# EAGLE board poseidon (EAGLE 9.2.2)
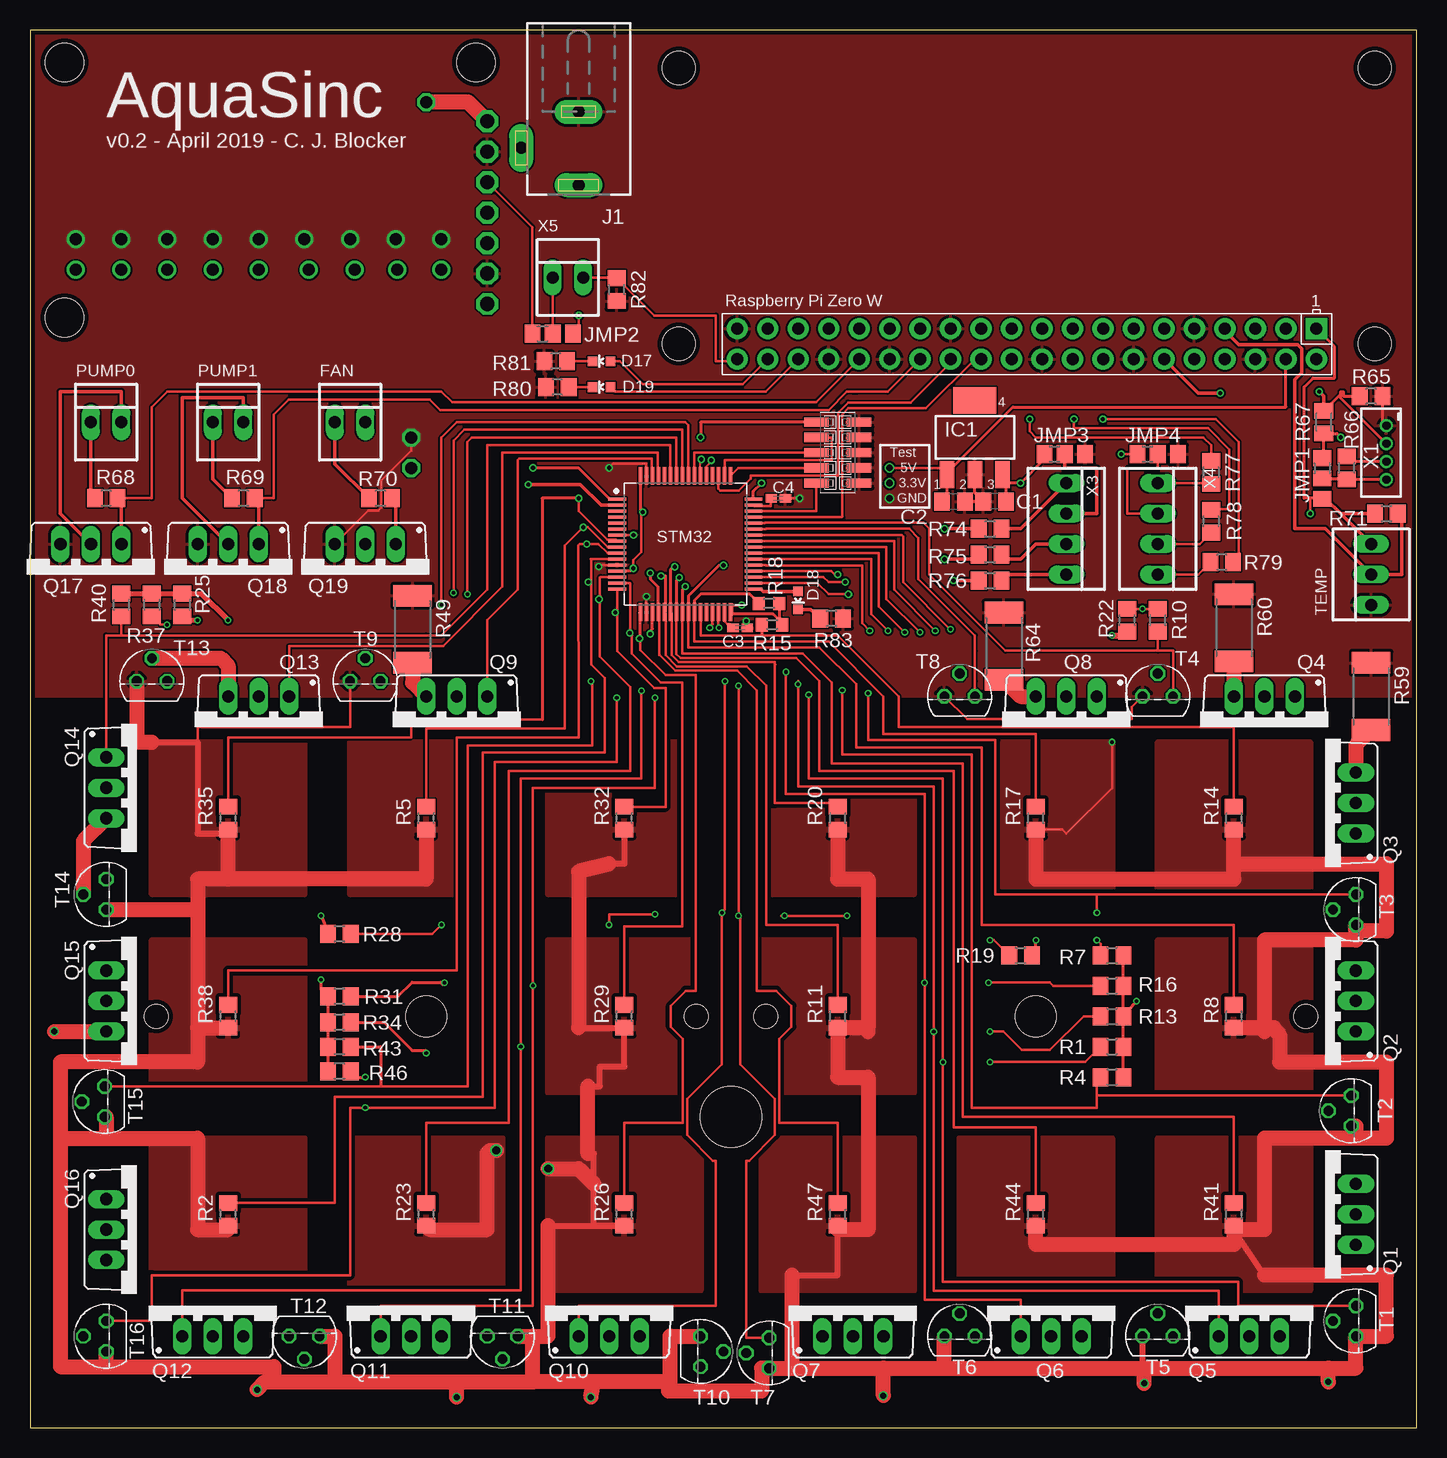
[diagram p3: board, top side]
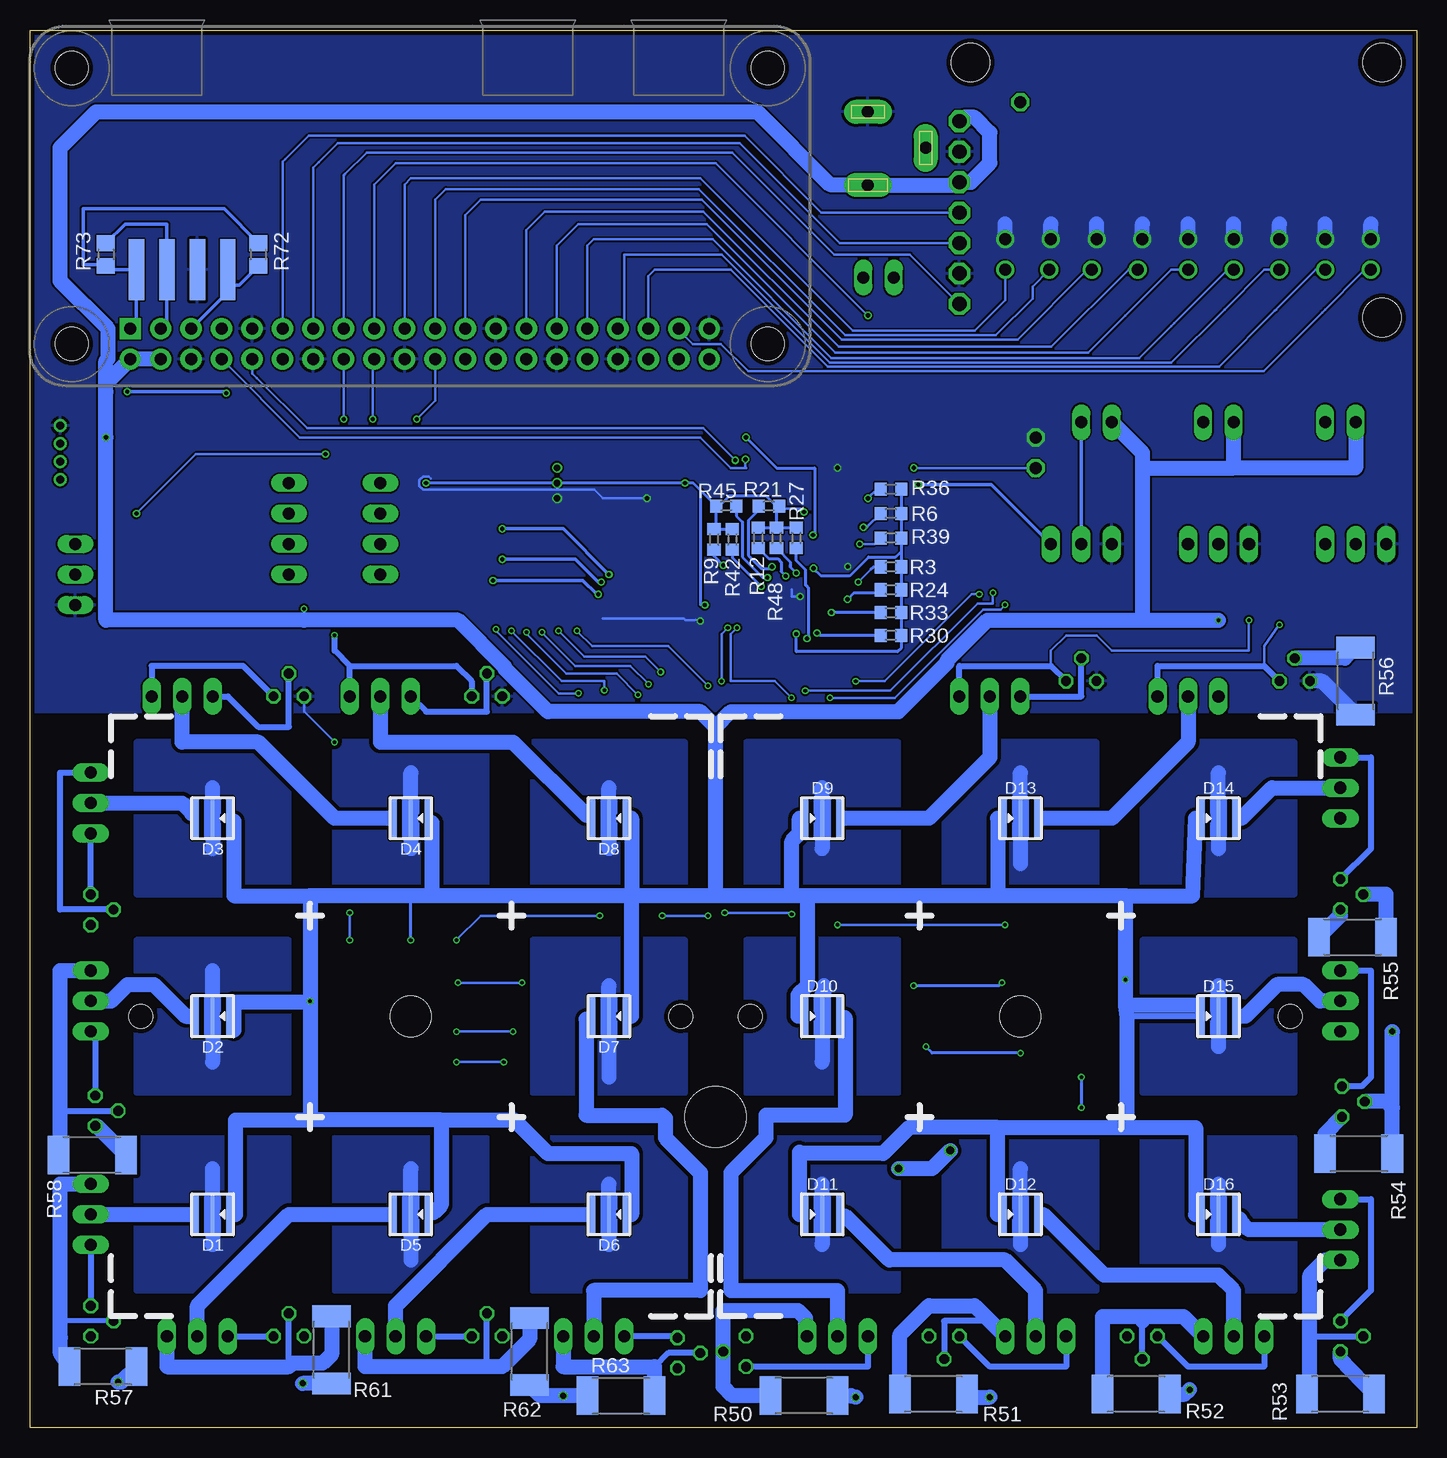
[diagram p4: board, bottom side, seen from below]

Size 115.55 x 116.51 mm. Coordinates in mm from the lower left corner, seen from the top.
Outline: 0,0 115.55,0 115.55,116.51 0,116.51 0,0
Copper layers (1*16): Top 0.035559375mm / dielectric 1.6mm / Bottom 0.035559375mm
Design rules "oshpark-2layer": minimum track width 6mil, minimum drill 10mil, track to track 6mil, track to pad 6mil, pad to pad 6mil, via to via 6mil, smd to smd 6mil, copper to edge 15mil, drill to drill 6mil, minimum pad ring 5mil, minimum via ring 5mil, stop-mask expansion 2.5mil, vias tented up to drill 0mil, thermal gap 10mil
Holes 5.08 mm at 58.42,25.91

## Footprints (pad centres in the part's own frame; a part is rotated, then mirrored left to right if it is on the bottom)
C0805 = smd 1.3 x 1.5: 1 -0.95,0; 2 0.95,0
C0402K = smd 0.925 x 0.74: 1 -0.6,0; 2 0.6,0
CREE-XT-E = smd 0.5 x 3.3: A -1.4,0; K 1.4,0 | smd 0.3 x 3.3: THERMAL 0,0
LED-0603 = smd 0.8 x 0.8: A 0,-0.75; C 0,0.75
22-23-2021 = drill 1 long: 1 -1.27,0; 2 1.27,0
SOT223 = smd 1.219 x 2.235: 1 -2.311,-3.099; 2 0,-3.099; 3 2.311,-3.099 | smd 3.6 x 2.2: 4 0,3.099
DCJ0202 = drill 1 pad 2 long: 1 0,3.1; 2 4.8,0; 3 0,-3
A0R-JMP = smd 1.5 x 1.3: 1 0,1.7; 2 0,0; 3 0,-1.7
TO220BV = drill 1.016 long: D 0,-2.54; G -2.54,-2.54; S 2.54,-2.54
R0805 = smd 1.3 x 1.5: 1 -0.95,0; 2 0.95,0
R0603 = smd 1 x 1.1: 1 -0.85,0; 2 0.85,0
R2512 = smd 1.8 x 3.2: 1 -2.8,0; 2 2.8,0
M0805 = smd 1.3 x 1.6: 1 -0.95,0; 2 0.95,0
TO92 = drill 0.813 octagon: 1 1.27,0; 2 0,1.905; 3 -1.27,0
22-23-2031 = drill 1 long: 1 -2.54,0; 2 0,0; 3 2.54,0
RASPBERRYPI_BASTELSTUBE_V13_RASPI_BOARD_B+_FULL = drill 1 pad 1.778 square: 1 8.37,25.23 | drill 1 pad 1.778: 2 8.37,27.77; 3 10.91,25.23; 4 10.91,27.77; 5 13.45,25.23; 6 13.45,27.77; 7 15.99,25.23; 8 15.99,27.77; 9 18.53,25.23; 10 18.53,27.77; 11 21.07,25.23; 12 21.07,27.77; 13 23.61,25.23; 14 23.61,27.77; 15 26.15,25.23; 16 26.15,27.77; 17 28.69,25.23; 18 28.69,27.77; 19 31.23,25.23; 20 31.23,27.77; 21 33.77,25.23; 22 33.77,27.77; 23 36.31,25.23; 24 36.31,27.77; 25 38.85,25.23; 26 38.85,27.77; 27 41.39,25.23; 28 41.39,27.77; 29 43.93,25.23; 30 43.93,27.77; 31 46.47,25.23; 32 46.47,27.77; 33 49.01,25.23; 34 49.01,27.77; 35 51.55,25.23; 36 51.55,27.77; 37 54.09,25.23; 38 54.09,27.77; 39 56.63,25.23; 40 56.63,27.77 | hole 2.75: 3.5,3.5; 3.5,26.5; 61.5,3.5; 61.5,26.5
QFP50P1200X1200X160-64 = smd 1.469 x 0.28: 1 -5.671,3.75; 2 -5.671,3.25; 3 -5.671,2.75; 4 -5.671,2.25; 5 -5.671,1.75; 6 -5.671,1.25; 7 -5.671,0.75; 8 -5.671,0.25; 9 -5.671,-0.25; 10 -5.671,-0.75; 11 -5.671,-1.25; 12 -5.671,-1.75; 13 -5.671,-2.25; 14 -5.671,-2.75; 15 -5.671,-3.25; 16 -5.671,-3.75; 33 5.671,-3.75; 34 5.671,-3.25; 35 5.671,-2.75; 36 5.671,-2.25; 37 5.671,-1.75; 38 5.671,-1.25; 39 5.671,-0.75; 40 5.671,-0.25; 41 5.671,0.25; 42 5.671,0.75; 43 5.671,1.25; 44 5.671,1.75; 45 5.671,2.25; 46 5.671,2.75; 47 5.671,3.25; 48 5.671,3.75 | smd 0.28 x 1.469: 17 -3.75,-5.671; 18 -3.25,-5.671; 19 -2.75,-5.671; 20 -2.25,-5.671; 21 -1.75,-5.671; 22 -1.25,-5.671; 23 -0.75,-5.671; 24 -0.25,-5.671; 25 0.25,-5.671; 26 0.75,-5.671; 27 1.25,-5.671; 28 1.75,-5.671; 29 2.25,-5.671; 30 2.75,-5.671; 31 3.25,-5.671; 32 3.75,-5.671; 49 3.75,5.671; 50 3.25,5.671; 51 2.75,5.671; 52 2.25,5.671; 53 1.75,5.671; 54 1.25,5.671; 55 0.75,5.671; 56 0.25,5.671; 57 -0.25,5.671; 58 -0.75,5.671; 59 -1.25,5.671; 60 -1.75,5.671; 61 -2.25,5.671; 62 -2.75,5.671; 63 -3.25,5.671; 64 -3.75,5.671
4PIN_SMD = smd 1.27 x 5.08: 1 -3.81,0; 2 -1.27,0; 3 1.27,0; 4 3.81,0
FOCUS_GRID = hole 3.4: 0,0 | hole 2: 22.5,0; -22.5,0
SIP = drill 1.2 octagon: 1 38.1,19.24; 2 38.1,16.7; 3 38.1,14.16; 4 38.1,11.62; 5 38.1,9.08; 6 38.1,6.54; 7 38.1,4 | hole 3.2: 2.87,24.13; 2.87,2.87; 37.16,24.13
B4B-ZR = drill 0.7 pad 1.1: 1 -2.25,0; 2 -0.75,0; 3 0.75,0; 4 2.25,0
1296-10 = smd 0.76 x 2.05: 1 -2.54,-1.78; 2 -2.54,1.78; 3 -1.27,-1.78; 4 -1.27,1.78; 5 0,-1.78; 6 0,1.78; 7 1.27,-1.78; 8 1.27,1.78; 9 2.54,-1.78; 10 2.54,1.78
22-23-2041 = drill 1 long: 1 -3.81,0; 2 -1.27,0; 3 1.27,0; 4 3.81,0

## Placement (x,y rotation side)
C1  [C0805]  80.39,77.22 180 top
C2  [C0805]  76.96,77.22 0 top
C3  2.2uF  [C0402K]  59.18,66.67 0 top
C4  [C0402K]  62.36,77.47 0 top
D1  CREE-XT-E-WHITE  [CREE-XT-E]  100.33,17.78 180 bottom
D2  CREE-XT-E-WHITE  [CREE-XT-E]  100.33,34.29 180 bottom
D3  CREE-XT-E-WHITE  [CREE-XT-E]  100.33,50.8 180 bottom
D4  CREE-XT-E-WHITE  [CREE-XT-E]  83.82,50.8 180 bottom
D5  CREE-XT-E-WHITE  [CREE-XT-E]  83.82,17.78 180 bottom
D6  CREE-XT-E-WHITE  [CREE-XT-E]  67.31,17.78 180 bottom
D7  CREE-XT-E-WHITE  [CREE-XT-E]  67.31,34.29 180 bottom
D8  CREE-XT-E-WHITE  [CREE-XT-E]  67.31,50.8 180 bottom
D9  CREE-XT-E-WHITE  [CREE-XT-E]  49.53,50.8 0 bottom
D10  CREE-XT-E-WHITE  [CREE-XT-E]  49.53,34.29 0 bottom
D11  CREE-XT-E-WHITE  [CREE-XT-E]  49.53,17.78 0 bottom
D12  CREE-XT-E-WHITE  [CREE-XT-E]  33.02,17.78 0 bottom
D13  CREE-XT-E-WHITE  [CREE-XT-E]  33.02,50.8 0 bottom
D14  CREE-XT-E-WHITE  [CREE-XT-E]  16.51,50.8 0 bottom
D15  CREE-XT-E-WHITE  [CREE-XT-E]  16.51,34.29 0 bottom
D16  CREE-XT-E-WHITE  [CREE-XT-E]  16.51,17.78 0 bottom
D17  LED0603  [LED-0603]  47.62,88.9 90 top
D18  LED0603  [LED-0603]  64.01,68.96 180 top
D19  LED0603  [LED-0603]  47.62,86.74 90 top
FAN  22-23-2021  [22-23-2021]  26.67,83.82 0 top
IC1  MCP1703DB  [SOT223]  78.74,82.55 0 top
J1  DCJ0202  [DCJ0202]  45.72,106.68 180 top
JMP1  0R-JUMPA  [A0R-JMP]  107.7,79.12 0 top
JMP2  0R-JUMPA  [A0R-JMP]  43.56,91.19 90 top
JMP3  0R-JUMPA  [A0R-JMP]  86.23,81.15 90 top
JMP4  0R-JUMPA  [A0R-JMP]  93.98,81.15 90 top
PUMP0  22-23-2021  [22-23-2021]  6.35,83.82 0 top
PUMP1  22-23-2021  [22-23-2021]  16.51,83.82 0 top
Q1  IRF512  [TO220BV]  107.95,17.78 90 top
Q2  IRF512  [TO220BV]  107.95,35.56 90 top
Q3  IRF512  [TO220BV]  107.95,52.07 90 top
Q4  IRF512  [TO220BV]  102.87,58.42 180 top
Q5  IRF512  [TO220BV]  101.6,10.16 0 top
Q6  IRF512  [TO220BV]  85.09,10.16 0 top
Q7  IRF512  [TO220BV]  68.58,10.16 0 top
Q8  IRF512  [TO220BV]  86.36,58.42 180 top
Q9  IRF512  [TO220BV]  35.56,58.42 180 top
Q10  IRF512  [TO220BV]  48.26,10.16 0 top
Q11  IRF512  [TO220BV]  31.75,10.16 0 top
Q12  IRF512  [TO220BV]  15.24,10.16 0 top
Q13  IRF512  [TO220BV]  19.05,58.42 180 top
Q14  IRF512  [TO220BV]  8.89,53.34 270 top
Q15  IRF512  [TO220BV]  8.89,35.56 270 top
Q16  IRF512  [TO220BV]  8.89,16.51 270 top
Q17  IRF512  [TO220BV]  5.08,71.12 180 top
Q18  IRF512  [TO220BV]  16.51,71.12 180 top
Q19  IRF512  [TO220BV]  27.94,71.12 180 top
R1  10k  [R0805]  90.17,31.75 0 top
R2  10k NTC  [R0805]  16.51,17.78 90 top
R3  10K  [R0603]  43.81,71.75 0 bottom
R4  10k  [R0805]  90.17,29.21 0 top
R5  10k NTC  [R0805]  33.02,50.8 90 top
R6  10K  [R0603]  43.81,76.2 0 bottom
R7  10k  [R0805]  90.17,39.37 0 top
R8  10k NTC  [R0805]  100.33,34.29 90 top
R9  10K  [R0603]  58.55,74.04 90 bottom
R10  10k  [R0805]  93.98,67.31 90 top
R11  10k NTC  [R0805]  67.31,34.29 90 top
R12  10K  [R0603]  54.86,74.17 90 bottom
R13  10k  [R0805]  90.17,34.29 0 top
R14  10k NTC  [R0805]  100.33,50.8 90 top
R15  10K  [R0603]  61.85,66.93 0 top
R16  10k  [R0805]  90.17,36.83 0 top
R17  10k NTC  [R0805]  83.82,50.8 90 top
R18  10K  [R0603]  61.59,68.71 0 top
R19  10k  [R0805]  82.55,39.37 0 top
R20  10k NTC  [R0805]  67.31,50.8 90 top
R21  10K  [R0603]  53.98,76.83 0 bottom
R22  10k  [R0805]  91.44,67.31 90 top
R23  10k NTC  [R0805]  33.02,17.78 90 top
R24  10K  [R0603]  43.81,69.85 0 bottom
R25  10k  [R0805]  12.7,68.58 90 top
R26  10k NTC  [R0805]  49.53,17.78 90 top
R27  10K  [R0603]  51.69,74.17 90 bottom
R28  10k  [R0805]  25.78,41.15 180 top
R29  10k NTC  [R0805]  49.53,34.29 90 top
R30  10K  [R0603]  43.81,66.04 0 bottom
R31  10k  [R0805]  25.78,35.94 180 top
R32  10k NTC  [R0805]  49.53,50.8 90 top
R33  10K  [R0603]  43.81,67.94 0 bottom
R34  10k  [R0805]  25.78,33.78 180 top
R35  10k NTC  [R0805]  16.51,50.8 90 top
R36  10K  [R0603]  43.81,78.23 0 bottom
R37  10k  [R0805]  10.16,68.58 90 top
R38  10k NTC  [R0805]  16.51,34.29 90 top
R39  10K  [R0603]  43.81,74.17 0 bottom
R40  10k  [R0805]  7.62,68.58 90 top
R41  10k NTC  [R0805]  100.33,17.78 90 top
R42  10K  [R0603]  57.02,74.04 90 bottom
R43  10k  [R0805]  25.78,31.75 180 top
R44  10k NTC  [R0805]  83.82,17.78 90 top
R45  10K  [R0603]  57.53,76.83 180 bottom
R46  10k  [R0805]  25.78,29.72 180 top
R47  10k NTC  [R0805]  67.31,17.78 90 top
R48  10K  [R0603]  53.34,74.17 90 bottom
R49  [R2512]  31.88,66.55 270 top
R50  [R2512]  51.05,2.67 180 bottom
R51  [R2512]  40.26,2.79 180 bottom
R52  [R2512]  23.37,2.79 180 bottom
R53  [R2512]  6.35,2.79 180 bottom
R54  [R2512]  4.83,22.86 0 bottom
R55  [R2512]  5.33,40.89 0 bottom
R56  [R2512]  5.08,62.23 90 bottom
R57  [R2512]  109.47,5.08 180 bottom
R58  [R2512]  110.36,22.73 180 bottom
R59  [R2512]  111.76,60.96 270 top
R60  [R2512]  100.33,66.67 270 top
R61  [R2512]  90.42,6.48 90 bottom
R62  [R2512]  73.91,6.35 90 bottom
R63  [R2512]  66.29,2.67 0 bottom
R64  [R2512]  81.15,65.15 270 top
R65  [R0805]  111.76,85.98 180 top
R66  [R0805]  109.73,80.01 90 top
R67  [M0805]  107.82,83.82 270 top
R68  [R0805]  6.35,77.47 180 top
R69  [R0805]  17.78,77.47 180 top
R70  [R0805]  29.21,77.47 180 top
R71  [R0805]  113.03,76.2 0 top
R72  [R0805]  96.52,97.79 270 bottom
R73  [R0805]  109.22,97.79 270 bottom
R74  [R0805]  80.01,74.93 0 top
R75  [R0805]  80.01,72.77 0 top
R76  [R0805]  80.01,70.61 0 top
R77  [R0805]  98.42,79.63 270 top
R78  [R0805]  98.42,75.56 270 top
R79  [R0805]  99.31,72.14 180 top
R80  [R0805]  43.94,86.74 180 top
R81  [R0805]  43.81,88.9 180 top
R82  [R0805]  48.9,94.87 90 top
R83  [R0805]  66.8,67.44 180 top
T1  2N5088  [TO92]  110.49,8.89 90 top
T2  2N5088  [TO92]  110.11,26.42 90 top
T3  2N5088  [TO92]  110.49,43.18 90 top
T4  2N5088  [TO92]  93.98,60.96 0 top
T5  2N5088  [TO92]  93.98,7.62 0 top
T6  2N5088  [TO92]  77.47,7.62 0 top
T7  2N5088  [TO92]  61.59,6.22 90 top
T8  2N5088  [TO92]  77.47,60.96 0 top
T9  2N5088  [TO92]  27.94,62.23 0 top
T10  2N5088  [TO92]  55.88,6.35 270 top
T11  2N5088  [TO92]  39.37,7.62 180 top
T12  2N5088  [TO92]  22.86,7.62 180 top
T13  2N5088  [TO92]  10.16,62.23 0 top
T14  2N5088  [TO92]  6.35,44.45 90 top
T15  2N5088  [TO92]  6.22,27.18 90 top
T16  2N5088  [TO92]  6.35,7.62 90 top
TEMP  22-23-2031  [22-23-2031]  111.76,71.12 90 top
U$1  RPI-ZERO  [RASPBERRYPI_BASTELSTUBE_V13_RASPI_BOARD_B+_FULL]  115.57,116.84 180 top
U$2  STM32F41  [QFP50P1200X1200X160-64]  54.61,73.66 0 top
U$3  AM2320  [4PIN_SMD]  102.87,96.52 0 bottom
U$19  8X_LED_OPTIC  [FOCUS_GRID]  33.02,34.29 0 bottom
U$20  8X_LED_OPTIC  [FOCUS_GRID]  83.82,34.29 0 bottom
U$21  SIM800L  [SIP]  0,89.66 0 top
X1  B4B-ZR  [B4B-ZR]  113.03,81.28 270 top
X2  1296-T10  [1296-10]  67.31,81.28 90 top
X3  22-23-2041  [22-23-2041]  86.36,74.93 270 top
X4  22-23-2041  [22-23-2041]  93.98,74.93 270 top
X5  22-23-2021  [22-23-2021]  44.83,95.88 0 top

## Tracks (layer width: path | path; a pad name or v marks a point on that pad's centre or on a via)
+3V3  (via drill 0.35, 0.55)
  Top 0.203: v50.27,71.63 50.27,72.33 50.92,72.99 50.92,76.33 v51.05,76.33 | U$2.64 50.86,78.7
  Top 0.254: C1.1 81.34,78.74 | 81.34,78.74 81.34,79.16 IC1.3 | v51.69,66.17 51.69,66.42 51.86,66.59 U$2.19 | R15.2 62.7,67.06 62.45,67.31 | 58.53,67.82 U$2.32 | 58.53,67.82 61.94,67.82 62.45,67.31 | U$2.13 50.05,71.41 v50.27,71.63 | 81.34,78.74 v82.55,78.74 84.53,80.72 JMP3.1 | U$2.48 60.28,78.06 v60.96,78.74 | R18.2 62.45,67.31 | 58.53,67.82 58.53,68.58 v59.31,68.58 | 50.86,78.7 50.86,76.52 v51.05,76.33
  Bottom 0.203: v51.05,76.33 51.35,76.62 53.34,76.62
  Bottom 0.254: R36.2 R6.2 R39.2 42.97,73.02 | 42.97,73.02 R3.2 R24.2 R33.2 R30.2 42.97,64.98 43.27,64.68 51.69,64.68 v51.69,66.17 | 42.97,73.02 43.41,72.58 45.66,72.58 47.25,70.99 49.63,70.99 v50.27,71.63 | R12.2 R48.2 | R48.2 R27.2 | R48.2 53.34,76.62 R21.2 53.38,76.83 54.21,77.66 57.3,77.66 58.13,76.83 R45.2 | R42.2 R9.2 58.38,75.06 R45.2 | R45.2 59.67,78.12 | 59.67,78.12 60.29,78.74 v60.96,78.74 v71.63,78.74 v82.55,78.74 | v59.31,68.58 59.67,68.58 59.67,78.12
B
  Top 0.305: X3.4 81.47,71.12 R76.2
B_
  Top 0.203: R79.2 97.35,71.12 X4.4
CK
  Top 0.203: X2.4 59.04,80.01 U$2.49
CTRL_D1  (via drill 0.3)
  Top 0.203: T1.1 100.69,10.16 100.69,12.14 76.07,12.14 v76.07,30.48 76.07,54.1 64.9,54.1 v64.9,61.09 | R1.1 87.95,30.48 v80.01,30.48 | v74.17,66.29 71.37,69.09 71.37,73.41 U$2.40
  Bottom 0.203: v80.01,30.48 v76.07,30.48 | v64.9,61.09 66.67,62.87 70.87,62.87 74.17,66.17 v74.17,66.29
  Bottom 0.508: Q1.G T1.1
CTRL_D2  (via drill 0.3)
  Top 0.203: T2.1 88.9,27.69 | v67.69,61.47 67.69,56.11 78.46,56.11 78.46,26.67 88.9,26.67 | 88.9,27.69 88.9,26.67 | R4.1 88.9,28.89 88.9,27.69 | 88.9,27.69 88.9,26.67 | v75.44,66.42 72.01,69.85 72.01,73.91 61.34,73.91 U$2.41
  Bottom 0.203: v67.69,61.47 67.69,62.23 71.25,62.23 v75.44,66.42
  Bottom 0.508: Q2.G 110.11,32.64 T2.1
CTRL_D3  (via drill 0.3)
  Top 0.203: T3.1 88.9,44.45 | 88.9,44.45 80.44,44.45 80.44,57.33 69.85,57.33 v69.85,61.21 | R7.1 89.22,40.32 v88.9,40.64 | v88.9,42.93 88.9,44.45 | v76.71,66.55 72.77,70.48 72.77,74.3 72.64,74.42 61.34,74.42 61.33,74.41 U$2.42
  Bottom 0.203: v88.9,40.64 v88.9,42.93 | v69.85,61.21 71.5,61.21 76.71,66.42 v76.71,66.55
  Bottom 0.508: T3.1 Q3.G
CTRL_D4
  Top 0.203: T4.1 95.25,64.77 93.98,64.77 | 93.98,64.77 81.28,64.77 74.93,71.12 74.93,74.93 74.42,75.44 61.27,75.44 61.24,75.41 U$2.44 | R10.1 93.98,64.77
  Bottom 0.508: T4.1 97.79,63.5 105.41,63.5 Q4.G
CTRL_D5  (via drill 0.3)
  Top 0.203: Q5.G 99.06,11.4 75.31,11.4 v75.31,33.02 75.31,53.47 64.01,53.47 v64.01,61.98 64.01,62.23 | R13.1 87.81,34.29 84.99,31.47 82.65,31.47 81.11,33.02 v80.01,33.02 | v72.9,66.29 70.74,68.45 70.74,72.9 60.29,72.9 U$2.39
  Bottom 0.203: v80.01,33.02 v75.31,33.02 | v64.01,61.98 65.53,63.5 70.1,63.5 v72.9,66.29
  Bottom 0.508: Q5.G T5.1
CTRL_D6  (via drill 0.3)
  Top 0.203: Q6.G 82.55,10.67 74.55,10.67 v74.55,37.08 74.55,52.83 62.99,52.83 v62.99,62.99 | R16.1 85.27,36.83 84.99,37.11 79.78,37.11 79.76,37.08 v79.88,37.08 | v71.5,66.42 70.1,67.82 70.1,72.39 60.3,72.39 U$2.38
  Bottom 0.203: v79.88,37.08 v74.55,37.08 | v62.99,62.99 64.26,64.26 69.34,64.26 v71.5,66.42
  Bottom 0.508: Q6.G T6.1
CTRL_D7  (via drill 0.3)
  Top 0.203: T7.1 59.69,7.49 59.69,22.25 59.94,22.25 62.08,24.39 62.08,27.42 59.2,30.3 59.2,42.67 v59.05,42.67 59.05,61.6 v59.05,61.85 | R19.1 80.33,40.64 v80.01,40.64 | v68.07,42.67 v62.87,42.67 | v62.87,42.67 62.61,42.67 v62.87,42.67 | v69.98,66.42 69.34,67.06 69.34,71.88 61.34,71.88 61.31,71.91 U$2.37
  Bottom 0.203: v80.01,40.64 77.98,42.67 v68.07,42.67 | v62.87,42.67 v59.05,42.67 | v59.05,61.85 62.36,65.15 68.71,65.15 v69.98,66.42
  Bottom 0.508: T7.1 61.72,7.62 Q7.G
CTRL_D8  (via drill 0.3)
  Top 0.203: T8.1 78.74,62.23 78.74,64.77 78.74,66.04 74.04,70.74 74.04,74.17 73.28,74.93 61.34,74.93 61.32,74.91 U$2.43
  Top 0.508: v90.17,66.04 91.44,66.04 R22.1
  Bottom 0.508: Q8.G 88.9,63.5 | 88.9,63.5 80.01,63.5 78.74,62.23 T8.1 | 88.9,63.5 90.17,64.77 v90.17,66.04
CTRL_D9  (via drill 0.3)
  Top 0.203: Q9.G 38.1,67.31 40.64,69.85 40.64,80.64 40.77,80.77 51.82,80.77 51.82,79.38 U$2.62
  Top 0.406: R25.1 13.02,67.31 v13.97,67.31
  Bottom 0.203: v13.97,67.31 13.97,64.77 25.4,64.77 26.67,66.04 29.21,66.04 30.48,64.77 30.48,63.5
  Bottom 0.508: Q9.G 38.1,63.5 30.48,63.5 T9.1
CTRL_D10  (via drill 0.3)
  Top 0.203: Q10.G 45.72,10.16 57.15,10.16 57.15,22.25 56.91,22.25 54.76,24.39 54.76,27.42 57.64,30.3 57.64,42.69 57.53,42.8 v57.66,42.93 57.91,43.18 v57.91,62.23 | R28.1 33.53,41.15 v34.29,41.91 | v48.26,41.91 48.26,42.8 v52.07,42.8 | U$2.30 57.36,66.72 v57.4,66.67
  Bottom 0.203: v34.29,41.91 v48.26,41.91 | v57.66,42.93 52.2,42.93 v52.07,42.8 | v57.91,62.23 57.91,66.17 v57.4,66.67
  Bottom 0.508: Q10.G 45.72,5.08 T10.1
CTRL_D11  (via drill 0.3)
  Top 0.203: Q11.G 29.21,10.16 41.91,10.16 v41.91,36.83 41.91,53.34 52.07,53.34 v52.07,60.82 v52.08,60.83 | v56.64,66.67 56.64,66.8 56.84,67 | 56.84,67 56.9,67 | 56.84,67 56.86,67.02 U$2.29
  Top 0.254: R31.1 30.65,35.94 31.84,37.13 34.2,37.13 34.4,36.94 v34.55,37.1
  Bottom 0.203: v52.08,60.83 53.48,62.23 57.15,62.23 57.15,66.17 v56.64,66.67
  Bottom 0.254: v34.55,37.1 34.82,36.83 v41.91,36.83
  Bottom 0.508: Q11.G 29.21,5.08 35.56,5.08 T11.1
CTRL_D12  (via drill 0.3)
  Top 0.203: Q12.G 12.7,11.43 40.89,11.43 v40.89,31.75 40.89,54.1 50.93,54.1 50.93,61.4 v50.95,61.42 | v35.31,69.6 35.31,82.3 36.2,83.19 54.36,83.19 U$2.57
  Top 0.254: R34.1 29.51,33.78 31.84,31.45 33.02,31.45 v33.02,31.22
  Bottom 0.203: v50.95,61.42 50.95,61.44 43.84,61.44 36.58,68.71 35.31,68.71 v35.31,69.6
  Bottom 0.254: v33.02,31.22 40.37,31.22 v40.89,31.75
  Bottom 0.508: Q12.G 12.7,5.08 19.05,5.08 T12.1
CTRL_D13  (via drill 0.3)
  Top 0.203: Q13.G 21.59,65.15 28.96,65.15 29.08,65.15 34.42,65.15 39.37,70.1 39.37,81.28 52.32,81.28 52.32,80.39 | R37.1 10.86,66.93 v11.43,66.93 | 52.32,80.39 52.32,80.32 | 52.32,80.32 52.32,80.39 | 52.32,80.32 52.32,79.37 U$2.61
  Bottom 0.203: v11.43,66.93 12.7,65.15 12.7,63.5
  Bottom 0.508: Q13.G 21.59,63.5 12.7,63.5 T13.1
CTRL_D14
  Top 0.203: Q14.G 6.35,66.04 7.62,66.04 | 7.62,66.04 33.02,66.04 34.29,66.04 38.1,69.85 38.1,81.91 53.34,81.91 53.34,79.35 U$2.59 | R40.1 7.62,66.04
  Bottom 0.508: Q14.G 3.81,55.88 3.81,48.26 T14.1
CTRL_D15  (via drill 0.3)
  Top 0.203: T15.1 29.21,28.45 36.47,28.45 36.47,56.87 46.86,56.87 46.86,62.1 v46.74,62.23 | v36.45,69.47 36.45,82.17 36.83,82.55 53.85,82.55 53.85,79.34 U$2.58
  Top 0.254: R43.1 29.21,31.75 29.21,28.45
  Bottom 0.203: v46.74,62.23 44.32,62.23 37.08,69.47 v36.45,69.47
  Bottom 0.508: Q15.G 3.81,38.1 3.81,29.21 4.57,28.45 T15.1
CTRL_D16  (via drill 0.3)
  Top 0.203: T16.1 10.16,8.89 10.16,12.7 26.67,12.7 26.67,26.67 v27.94,26.67 38.73,26.67 38.73,55.5 48.9,55.5 v48.9,60.83 | v34.29,68.58 34.29,82.55 35.56,83.82 54.61,83.82 54.86,83.57 54.86,80.39 | 54.86,80.32 54.86,80.39 | 54.86,80.39 U$2.56
  Top 0.254: R46.1 27.37,29.21 v27.94,29.21
  Bottom 0.203: v34.29,68.58 34.67,68.2 36.13,68.2 43.5,60.83 v48.9,60.83
  Bottom 0.254: v27.94,29.21 v27.94,26.67
  Bottom 0.508: Q16.G 3.81,19.05 3.81,11.43 T16.1
DI
  Top 0.203: U$2.50 57.91,79.38 57.91,80.64 66.81,80.64 66.81,82.55 X2.8
DO
  Top 0.203: X2.6 55.37,81.28 55.37,79.34 U$2.55
FAN  (via drill 0.35)
  Top 0.305: Q19.G 30.48,77.15 R70.1 | v41.53,78.61 45.87,78.61 47.59,76.89 48.92,76.89 U$2.2
  Bottom 0.305: v41.53,78.61 35.43,78.61 Q19.G
G
  Top 0.305: X3.3 83.82,73.66 82.55,72.39 81.34,72.39 R75.2
G_
  Top 0.203: X4.3 97.47,73.66 R78.2
GND  (via drill 0.3, 0.35, 0.5, 0.55, 0.65, 1, 1 pad 1.3)
  Top 0.203: v90.17,57.15 90.17,53.34 86.36,49.53 86.04,49.85 R17.1 | T9.3 26.67,58.42 13.97,58.42 13.97,57.15 | T8.3 78.11,59.05 91.82,59.05 91.82,60.07 T4.3 | U$2.18 v51.36,69.28 v51.37,69.28 | U$2.12 47.53,71.91 v47.4,71.78 | U$2.63 51.36,80.38 48.62,80.38 v48.26,80.01 | C3.2 59.69,66.77 v59.69,67.24 | C4.2 v64.14,77.47 | Q19.S 28.21,76.47 29.02,76.47 29.26,76.71 29.26,78.94 31.75,81.43 v31.75,82.55
  Top 0.254: X1.1 112.71,83.85 R65.1 | C2.2 C1.2 78.74,77.92 IC1.2 78.74,80.01
  Top 0.508: 46.48,28.45 47.5,28.45 47.5,30.1 49.53,30.1 R29.1 45.72,33.34 | 46.48,22.86 46.99,22.86 46.99,20.32 46.99,16.83 R26.1 43.18,16.83 | R32.1 49.53,46.99 48.26,46.99 | 102.87,12.7 100.33,16.51 | 63.5,12.7 67.31,12.7 67.31,16.51 | 92.71,4.95 T5.3 | 41.91,7.62 T11.3 | R35.1 16.51,49.53 13.97,49.53 13.97,57.15 10.16,57.15
  Top 1.27: 46.48,22.86 46.48,28.45 | 48.26,46.99 45.72,46.36 45.72,33.34 | R47.1 67.31,16.51 69.85,16.51 69.85,29.21 67.31,29.21 R11.1 69.85,33.34 | R20.1 67.31,45.72 69.85,45.72 69.85,33.34 | 69.85,33.02 69.85,33.34 | R17.1 83.82,45.72 100.33,45.72 100.33,46.99 | 100.33,46.99 R14.1 | 102.87,33.02 102.87,33.34 | 102.87,33.34 R8.1 | 100.33,46.99 113.03,46.99 113.03,41.4 110.49,41.4 T3.3 110.49,40.64 102.87,40.64 102.87,33.34 | 102.87,33.34 103.67,33.34 103.67,33.19 104.14,32.72 104.14,30.48 113.03,30.48 113.03,24.13 110.49,24.13 | 110.49,24.13 102.87,24.13 102.87,16.51 100.33,16.51 | T2.3 110.49,25.15 110.49,24.13 | R41.1 100.33,16.51 | 100.33,16.51 100.33,15.24 83.82,15.24 R44.1 | R5.1 33.02,45.72 16.51,45.72 | 16.51,45.72 R35.1 | 16.51,45.72 13.97,45.72 13.97,43.18 | 13.97,43.18 13.97,33.34 | 13.97,33.34 R38.1 | 13.97,33.34 13.97,30.48 2.54,30.48 2.54,24.13 | R2.1 16.51,16.51 13.97,16.51 13.97,24.13 6.35,24.13 | 2.54,24.13 6.35,24.13 | T15.3 6.35,25.91 6.35,24.13 | 102.87,12.7 113.03,12.7 113.03,7.62 T1.3 110.49,4.95 108.2,4.95 | 63.5,4.95 T7.3 60.96,4.95 60.96,3.05 53.21,3.05 53.34,3.81 | 63.5,4.95 63.5,12.7 | 63.5,4.95 71.12,4.95 | 71.12,4.95 76.2,4.95 | 76.2,4.95 T6.3 | 76.2,4.95 92.71,4.95 | 92.71,4.95 108.2,4.95 | 53.34,3.81 53.34,7.62 T10.3 | 53.34,3.81 46.99,3.81 | 46.99,3.81 41.91,3.81 | 41.91,3.81 41.91,7.62 | 2.54,24.13 2.54,5.08 6.35,5.08 | 6.35,5.08 T16.3 | 6.35,5.08 20.32,5.08 20.32,3.81 | 20.32,3.81 25.4,3.81 | 25.4,3.81 35.56,3.81 | 35.56,3.81 41.91,3.81 | T11.3 43.18,7.62 43.18,16.83 | R23.1 33.34,16.51 38.1,16.51 38.1,22.86 38.35,23.11 v38.86,23.11 | v43.18,21.59 45.72,21.59 46.99,20.32 | T12.3 25.4,7.62 25.4,3.81
  Top 1.27: T14.3 13.97,43.18 | T13.3 8.89,57.15 10.16,57.15 | v18.92,3.17 19.56,3.81 20.32,3.81 | v35.56,2.54 35.56,3.81 | v46.74,2.54 46.99,3.81 | v71.12,2.67 71.12,4.95 | v92.84,3.68 92.84,4.83 92.71,4.95 | v108.2,3.81 108.2,4.95
  Bottom 0.203: T4.3 92.71,59.69 v90.17,57.15 | v51.37,69.28 52.07,69.28 52.07,69.85 | v59.69,67.24 59.69,67.31 60.96,67.31 61.09,67.44 67.82,67.44 | v64.14,77.47 67.82,77.47 68.53,78.18 82.78,78.18 83.11,78.51 83.11,78.97 82.78,79.3 82.32,79.3 82.14,79.12
  Bottom 1.27: v38.86,23.11 40.39,21.59 v43.18,21.59 | R55.1 6.35,42.68 T14.3 | R56.1 7.88,62.23 T13.3 | R54.1 7.63,24.5 T15.3 | R53.1 6.35,5.72 T16.3 | R52.1 19.3,2.79 v18.92,3.17 | R51.1 37.2,2.54 v35.56,2.54 | R50.1 47.12,2.67 v46.74,2.54 | R63.1 v71.12,2.67 73.03,2.67 R62.1 | R61.1 v92.83,3.68 v92.84,3.68 | R57.1 107.94,3.81 v108.2,3.81 | R58.1 109.98,25.15 T2.3 | v3.81,99.06 3.81,100.33 | v7.62,99.06 7.62,100.33 | v11.43,99.06 11.43,100.33 | v15.24,99.06 15.24,100.33 | v19.05,99.06 19.05,100.33 | v22.86,99.06 22.86,100.33 | v26.67,99.06 26.67,100.33 | v30.48,99.06 30.48,100.33 | v34.29,99.06 34.29,100.33
  other vias: 71.63,77.47
  pour Top (isolate 0.305): 10.16,57.15 22.86,57.15 22.86,44.45 10.16,44.45
  pour Top (isolate 0.305): 43.18,40.64 55.88,40.64 55.88,27.94 43.18,27.94
  pour Top (isolate 0.305): 43.18,24.13 55.88,24.13 55.88,11.43 43.18,11.43
  pour Top (isolate 0.305): 26.67,24.13 39.37,24.13 39.37,11.43 26.67,11.43
  pour Top: 26.67,57.15 39.37,57.15 39.37,44.45 26.67,44.45
  pour Top (isolate 0.305): 43.18,57.15 55.88,57.15 55.88,44.45 43.18,44.45
  pour Top (isolate 0.305): 10.16,40.64 22.86,40.64 22.86,27.94 10.16,27.94
  pour Top (isolate 0.305): 10.16,24.13 22.86,24.13 22.86,11.43 10.16,11.43
  pour Top (isolate 0.305): 60.96,57.15 73.66,57.15 73.66,44.45 60.96,44.45
  pour Top (isolate 0.305): 77.47,57.15 90.17,57.15 90.17,44.45 77.47,44.45
  pour Top (isolate 0.305): 93.98,57.15 106.68,57.15 106.68,44.45 93.98,44.45
  pour Top (isolate 0.305): 60.96,40.64 73.66,40.64 73.66,27.94 60.96,27.94
  pour Top (isolate 0.305): 60.96,24.13 73.66,24.13 73.66,11.43 60.96,11.43
  pour Top (isolate 0.305): 77.47,24.13 90.17,24.13 90.17,11.43 77.47,11.43
  pour Top (isolate 0.305): 93.98,24.13 106.68,24.13 106.68,11.43 93.98,11.43
  pour Top (isolate 0.305): 93.98,40.64 106.68,40.64 106.68,27.94 93.98,27.94
  pour Top (isolate 0.305): 26.67,57.15 39.37,57.15 39.37,44.45 26.67,44.45
  pour Top: 0,116.84 115.57,116.84 115.57,60.96 0,60.96
  pour Bottom: 0,116.84 115.57,116.84 115.57,59.69 0,59.69
GSM_RST
  Bottom 0.203: U$21.7 42.23,97.79 48.51,97.79 57.02,106.3 87.5,106.3 89.28,104.52 | 89.28,104.52 89.41,104.39 | U$1.15 89.42,104.38 89.28,104.52
MS
  Top 0.203: U$2.46 65.53,76.41 X2.2
N$1
  Top 0.305: Q17.D 2.54,76.2 2.54,86.36 7.62,86.36 PUMP0.2
N$2
  Bottom 0.508: 102.23,17.78 D1.K
  Bottom 1.27: Q1.D 102.23,17.78
N$3  (via drill 0.35, 1)
  Top 0.254: U$2.1 48.32,77.41 45.72,80.01 v41.91,80.01
  Bottom 0.203: v41.91,80.01 v31.75,80.01
N$4
  Bottom 0.406: T1.2 113.03,8.89
  Bottom 1.27: Q1.S 113.03,20.32 113.03,8.89 113.01,7.51 113.01,6.2 R57.2
N$5
  Top 0.203: D19.C R80.1
N$6
  Top 0.254: X1.3 110.16,80.53 R66.2
N$7
  Bottom 0.508: 102.23,34.29 D2.K
  Bottom 1.27: 102.23,34.29 102.57,34.29 105.22,36.94 107.42,36.94 108.8,35.56 Q2.D
N$8
  Bottom 0.508: 113.03,38.1 113.03,26.67 112.78,26.42 T2.2
  Bottom 1.27: R58.2 113.03,22.87 113.03,38.1 Q2.S
N$9
  Top 0.254: X1.4 109.76,79.03 R66.1 107.76,79.06 JMP1.2
N$10
  Top 0.305: Q18.D 12.7,77.47 12.7,85.85 17.78,85.85 PUMP1.2
N$11
  Bottom 0.508: 102.11,51.18 D3.K
  Bottom 1.27: Q3.D 102.87,52.07 102.11,51.31 102.11,51.18
N$12
  Top 1.27: R59.2 110.49,56.89 Q3.S
  Bottom 0.508: T3.2 113.03,43.18 113.03,54.61 Q3.S
N$13
  Top 0.203: D17.C R81.1
N$14
  Bottom 0.305: FAN.2 Q19.D
N$15
  Bottom 0.508: 85.85,50.8 D4.K
  Bottom 1.27: 85.85,50.8 90.17,50.8 96.52,57.15 102.87,57.15 Q4.D
N$16
  Top 1.27: R60.2 Q4.S
  Bottom 0.508: Q4.S 99.06,60.96 96.52,58.42 93.98,58.42 T4.2
N$17
  Top 0.305: U$1.7 99.58,91.43 100.74,90.26 105.66,90.26 105.98,89.94 105.98,87.94 105.41,87.37 105.41,74.93 107.95,74.93 TEMP.2 114.3,71.12 114.3,75.88 R71.2
N$18
  Bottom 0.305: U$1.3 104.14,92.13 U$3.2 104.14,100.33 107.63,100.33 R73.1
N$19
  Bottom 0.508: 85.72,17.78 D5.K
  Bottom 1.27: Q5.D 101.6,10.16 93.98,17.78 85.72,17.78
N$20
  Bottom 0.508: 93.98,5.08 T5.2
  Bottom 1.27: R61.2 90.42,6.1 91.16,5.36 93.7,5.36 93.98,5.08 104.14,5.08 Q5.S
N$21
  Bottom 0.305: U$1.5 99.06,94.67 99.06,95.25 | 99.06,95.25 U$3.4 | R72.2 98.11,95.25 99.06,95.25
N$22
  Top 0.203: X4.2 91.44,76.2 91.44,80.01 93.98,80.01 JMP4.2
N$23
  Bottom 0.508: 69.22,17.78 D6.K
  Bottom 1.27: Q6.D 85.09,10.16 77.47,17.78 69.22,17.78
N$24
  Bottom 0.508: 77.47,5.08 T6.2
  Bottom 1.27: R62.2 73.91,7.37 76.2,5.08 77.47,5.08 87.63,5.08 Q6.S
N$25
  Top 0.305: X3.2 88.9,76.2 88.9,80.01 86.23,80.01 JMP3.2
N$26
  Top 0.203: D19.A 48.76,86.36 61.31,86.36 U$1.36
N$27
  Bottom 0.508: 69.22,34.04 68.96,34.29 D7.K
  Bottom 1.27: 69.22,34.04 69.22,26.04 62.87,26.04 62.61,25.78 62.61,24.17 59.69,21.25 59.69,11.43 68.58,11.43 Q7.D
N$28
  Bottom 0.508: T7.2 62.36,6.22 63.5,5.08
  Bottom 1.27: R63.2 63.5,5.08 71.12,5.08 Q7.S
N$29
  Top 0.203: U$1.38 59.41,86.99 51.05,86.99 49.15,88.9 D17.A
N$30
  Top 0.203: JMP2.2 X5.1
N$31
  Bottom 0.508: 69.22,51.05 68.96,50.8 D8.K
  Bottom 1.27: Q8.D 86.36,57.15 75.31,57.15 69.22,51.05
N$32
  Top 1.27: R64.2 82.54,60.96 Q8.S
  Bottom 0.508: Q8.S 82.55,59.69 77.47,59.69 T8.2
N$33  (via drill 1)
  Bottom 0.203: U$1.19 84.34,103.62 83.82,104.14 59.69,104.14 46.99,91.44 36.83,91.44 34.29,93.98 v34.29,96.52
N$35
  Bottom 0.508: 47.62,50.8 D9.K
  Bottom 1.27: Q9.D 35.56,55.88 40.64,50.8 47.62,50.8
N$36
  Top 1.27: R49.2 31.88,62.1 Q9.S
  Bottom 0.508: Q9.S 27.94,60.96 T9.2
N$37  (via drill 1)
  Bottom 0.203: U$1.21 81.8,102.35 80.9,103.25 59.82,103.25 47.62,91.06 35.05,91.06 32,94.11 32,95.12 v30.61,96.52
N$38  (via drill 1)
  Bottom 0.203: U$1.23 79.26,101.08 77.98,102.36 59.56,102.36 47.9,90.7 33.25,90.7 27.44,96.52 v27.05,96.52
N$39
  Bottom 0.508: 47.62,34.16 48,34.16 D10.K
  Bottom 1.27: Q10.D 48.26,11.43 57.15,11.43 57.15,21.25 54.23,24.17 54.23,26.04 47.62,26.04 47.62,34.16
N$40
  Bottom 1.27: R50.2 57.02,2.67 57.78,3.43 T10.2 57.78,9.78 51.56,9.78 50.93,9.14 50.93,7.75 Q10.S
N$41  (via drill 1)
  Bottom 0.203: U$1.27 74.18,99.81 72.64,101.35 59.43,101.35 48.17,90.09 30.43,90.09 24.01,96.52 v23.24,96.52
N$42  (via drill 1)
  Bottom 0.203: U$1.29 71.64,98.54 69.85,100.33 59.17,100.33 48.45,89.61 27.36,89.61 24.26,92.71 20.45,96.52 v19.05,96.52
N$43
  Bottom 0.508: 47.62,17.65 47.75,17.78 D11.K
  Bottom 1.27: Q11.D 31.75,11.43 34.29,13.97 43.94,13.97 47.62,17.65
N$44
  Bottom 0.508: Q11.S 35.56,8.89 39.37,8.89 T11.2
  Bottom 1.27: R51.2 43.06,7.74 40.64,10.16 36.83,10.16 Q11.S
N$45  (via drill 1)
  Bottom 0.203: U$1.31 69.1,98.54 68.58,99.06 58.67,99.06 48.77,89.15 23.11,89.15 20.45,91.82 20.19,92.08 15.49,96.77 v15.24,96.52
N$46  (via drill 1)
  Bottom 0.203: U$1.33 66.04,92.13 66.04,97.79 57.91,97.79 48.91,88.8 20.43,88.8 16.01,93.22 | 16.01,93.22 16,93.22 | 16.01,93.22 12.71,96.52 v11.43,96.52
N$47
  Bottom 0.508: 31.11,17.78 D12.K
  Bottom 1.27: Q12.D 15.24,11.43 16.51,12.7 26.04,12.7 31.11,17.78
N$48
  Bottom 0.508: T12.2 22.86,8.89
  Bottom 1.27: R52.2 26.17,9.27 26.16,9.27 25.4,9.27 24.13,9.27 22.86,9.27 | Q12.S 19.43,9.27 22.86,9.27 | 22.86,8.89 22.86,9.27
N$49  (via drill 1)
  Bottom 0.203: U$1.35 64.02,96 63.5,96.52 57.14,96.52 49.06,88.44 16.46,88.44 11.81,93.09 | 11.68,93.22 11.69,93.22 11.81,93.09 | 11.81,93.09 8.39,96.52 v7.62,96.52
N$50  (via drill 1 pad 1.3)
  Bottom 0.203: 7.87,92.96 12.75,88.09 55.71,88.09 57.97,90.34 60.3,90.34 61.48,91.52 U$1.37 | 7.87,92.96 7.62,93.22 | 7.87,92.96 4.32,96.52 v3.81,96.52
N$51
  Bottom 0.508: 31.11,50.8 D13.K
  Bottom 1.27: Q13.D 19.05,57.15 25.4,50.8 31.11,50.8
N$52
  Top 1.27: T13.2 15.88,64.14 16.51,63.5 Q13.S
  Bottom 1.27: R56.2 5.97,64.14 T13.2
N$55
  Bottom 0.508: D14.K 14.61,50.8
  Bottom 1.27: 14.61,50.8 12.06,53.34 Q14.D
N$56
  Top 1.27: Q14.S 4.45,48.9 T14.2
  Bottom 1.27: R55.2 2.54,44.45 T14.2
N$59
  Bottom 0.508: 14.61,34.29 D15.K
  Bottom 1.27: Q15.D 8.04,35.56 9.42,36.94 11.62,36.94 14.27,34.29 14.61,34.29
N$60  (via drill 0.5)
  Top 1.27: v2.03,33.02 Q15.S
  Bottom 1.27: R54.2 2.03,26.67 | 2.03,26.67 v2.03,33.01 v2.03,33.02 | 2.03,26.67 2.53,27.18 T15.2
N$63
  Bottom 0.508: 14.73,17.4 D16.K
  Bottom 1.27: Q16.D 13.97,16.51 14.73,17.27 14.73,17.4
N$64
  Bottom 0.508: 8.89,7.62 T16.2
  Bottom 1.27: Q16.S 7.62,13.97 8.89,12.7 8.89,7.62 8.89,2.8 R53.2
N$68
  Top 0.305: D18.C 65.08,68.21 R83.2
N$69
  Top 0.305: D18.A 61.1,69.71 60.9,69.91 U$2.33
N$70
  Top 0.203: C3.1 58.26,67 58.12,67 57.86,67.25 U$2.31
N$71
  Top 0.203: C4.1 61.72,77.44 61.72,76.83 60.36,76.83 U$2.47
NRST  (via drill 0.35)
  Top 0.203: 50.55,74.42 50.53,74.41 v50.29,74.41 U$2.7 | X2.10
  Top 0.254: v55.88,82.55 55.88,83.82 X2.10
  Bottom 0.254: v55.88,82.55 53.34,80.01 50.16,80.01 50.16,74.55 50.29,74.42 v50.29,74.41
P0
  Top 0.203: 65.15,85.47 64.64,85.47 | 64.64,85.47 65.5,85.47 U$1.32 | R68.1 10.16,77.47 10.16,85.09 11.43,86.36 34.29,86.36 35.18,85.47 35.56,85.47 | 64.64,85.47 35.56,85.47 | 35.56,85.47 35.43,85.47
  Top 0.305: Q17.G 7.62,77.15 R68.1
P1
  Top 0.203: 68.93,86.36 68.58,86.36 68.07,86.36 | R69.1 20.32,77.47 20.32,84.45 21.57,85.7 33.31,85.7 34.17,84.84 66.55,84.84 68.07,86.36 | U$1.28 71.47,86.36 68.07,86.36
  Top 0.305: Q18.G 19.05,77.15 R69.1
PI_3V3  (via drill 0.35)
  Top 0.203: JMP4.1 v90.93,81.15 | v106.68,76.2 106.68,77.47
  Top 0.254: JMP1.3 107.65,77.47 106.68,77.47 106.17,77.47 106.17,86.74 106.93,87.5 108.71,87.5 108.71,90.1 U$1.1
  Top 0.305: TEMP.3 109.22,76.2 | 109.22,76.2 108,77.42 JMP1.3 | R71.1 109.22,76.2
  Bottom 0.203: v90.93,81.15 101.73,81.15 v106.68,76.2
  Bottom 0.305: U$1.1 106.68,92.13 U$3.1 108.9,96.52 109.06,96.68 | R73.2 109.06,96.68 | 109.06,96.68 109.31,96.93 111.09,96.93 111.12,96.9 111.12,101.6 99.38,101.6 R72.1
PI_3V3_2  (via drill 0.35)
  Top 0.203: v45.72,92.71 45.72,91.64 JMP2.3
  Bottom 0.203: U$1.17 86.88,103.62 85.09,105.41 58.42,105.41 v45.72,92.71
PI_B  (via drill 0.35)
  Top 0.203: R79.1 100.71,72.58 100.71,82.17 98.81,84.07 v89.41,84.07 | v89.41,84.07 89.28,84.07 v89.41,84.07
  Bottom 0.203: U$1.16 89.41,89.06 v89.41,84.07
PI_G  (via drill 0.35)
  Top 0.203: R78.1 98.49,76.58 99.95,76.58 99.95,81.53 98.17,83.31 87,83.31 v87,84.07
  Bottom 0.203: v87,84.07 87,87.63 | 87,87.63 87,87.76 | 87,87.63 87,88.95 U$1.18
PI_R  (via drill 0.35)
  Top 0.203: R77.1 98.42,81.91 97.79,82.55 83.82,82.55 83.31,83.06 v83.31,84.07
  Bottom 0.203: v83.31,84.07 81.79,85.6 81.79,89.06 U$1.22
PI_RX
  Bottom 0.203: U$21.4 49.59,101.28 56.01,107.7 92.33,107.7 94.3,105.73 | 94.3,105.73 94.49,105.54 | 94.49,91.62 U$1.11 94.5,105.52 94.3,105.73
PI_STM32_0
  Top 0.203: U$2.45 67.66,75.91 67.69,75.95 67.69,84.45 68.21,84.97 74.65,84.97 78.75,89.07 U$1.24
PI_STM32_1
  Top 0.203: U$2.51 57.36,78.28 57.53,78.1 59.05,78.1 60.07,79.12 60.07,79.38 67.31,79.38 67.33,79.4 67.33,84.6 68.19,85.45 73.39,85.45 76.72,88.78 U$1.26
PI_TX
  Bottom 0.203: 38.16,98.81 U$21.5 48.07,98.74 56.39,107.06 89.92,107.06 91.5,105.47 | 91.5,105.47 91.96,105.02 | U$1.13 91.96,105.02 | 91.96,105.02 91.5,105.47
R
  Top 0.305: X3.1 82.55,74.93 R74.2
R_
  Top 0.203: X4.1 98.36,78.74 R77.2
SPILL_SENSE
  Top 0.203: X5.2 48.83,95.88 R82.2 52,92.71 57.15,92.71 57.15,88.9 58.77,88.9 U$1.40
STM32_B  (via drill 0.35)
  Top 0.203: v68.2,69.47 66.55,69.47 65.61,70.41 U$2.34
  Top 0.305: R76.1 v76.96,70.61
  Bottom 0.305: v76.96,70.61 69.47,70.61 68.33,69.47 v68.2,69.47
STM32_G  (via drill 0.35)
  Top 0.203: v67.94,70.48 66.55,70.48 66.12,70.91 U$2.35
  Top 0.305: R75.1 78.68,72.39 v76.2,72.39
  Bottom 0.305: v76.2,72.39 70.1,72.39 68.2,70.48 v67.94,70.48
STM32_R  (via drill 0.35)
  Top 0.203: v67.31,71.12 67.06,71.12 66.77,71.41 U$2.36
  Top 0.305: R74.1 v76.2,74.93
  Bottom 0.305: v76.2,74.93 71.12,74.93 v67.31,71.12
STM32_RX  (via drill 0.35)
  Top 0.152: U$2.54 55.86,80.62 55.93,80.69 v55.93,80.72
  Bottom 0.203: v55.93,80.72 55.93,80.06 55.88,80.01 57.15,80.01 59.69,82.55 93.06,82.55 U$1.8
STM32_TX  (via drill 0.35)
  Top 0.152: U$2.53 56.36,80.11 56.77,80.52 v56.77,80.64
  Bottom 0.203: v56.77,80.64 59.44,83.31 92.46,83.31 96.65,87.5 97.03,87.88 97.03,89.06 U$1.10
TEMP_D1  (via drill 0.35)
  Top 0.203: R41.2 100.33,25.91 77.72,25.91 77.72,55.37 66.8,55.37 66.8,62.1 64.39,64.52 54.36,64.52 54.36,67.82 U$2.24
  Top 0.254: v54.61,70.1 54.36,69.85 54.36,67.82
  Bottom 0.254: R42.1 57.02,72.52 v54.61,70.1
TEMP_D2  (via drill 0.35)
  Top 0.203: R8.2 100.33,41.91 79.32,41.91 79.32,56.72 68.83,56.72 68.83,61.98 65.79,65.02 54.86,65.02 54.86,65.03 54.86,67.82 U$2.25
  Top 0.254: 54.86,67.82 54.86,69.34 57.4,71.88 v57.78,71.88
  Bottom 0.254: R9.1 58.55,72.64 v57.78,71.88
TEMP_D3
  Top 0.203: R14.2 100.33,58.42 72.39,58.42 72.39,60.96 67.31,66.04 60.96,66.04 55.88,66.04 55.88,67.31 55.86,67.33 U$2.27
  Top 0.254: R15.1 60.96,66.89 60.96,66.04
TEMP_D4
  Top 0.203: R17.2 83.82,57.81 71.12,57.81 71.12,60.96 66.55,65.53 55.37,65.53 55.37,67.98 U$2.26
  Top 0.254: R18.1 59.96,69.49 55.9,69.49 55.36,68.95 U$2.26
TEMP_D5  (via drill 0.35)
  Top 0.203: R44.2 83.82,25.02 76.96,25.02 76.96,54.74 65.79,54.74 65.79,62.23 65.78,62.23 63.85,64.16 54.21,64.16 53.86,64.51 U$2.23
  Top 0.254: U$2.23 53.86,70.62 v54.1,70.87
  Bottom 0.254: R45.1 56.68,75.99 56.19,75.51 56.19,72.58 54.48,70.87 v54.1,70.87
TEMP_D6  (via drill 0.35)
  Top 0.203: R47.2 67.31,25.4 62.43,25.4 62.43,32.41 63.44,33.41 63.44,35.17 62.2,36.41 60.58,36.41 60.58,61.47 58.95,63.09 53.77,63.09 52.47,64.39 52.45,64.39 52.45,67.9 U$2.20
  Top 0.254: v51.69,71.25 51.69,70.74 52.32,70.1 52.32,68.02 U$2.20
  Bottom 0.254: R48.1 52.2,72.17 52.2,71.88 52.2,71.75 v51.69,71.25
TEMP_D7  (via drill 0.35)
  Top 0.203: R11.2 67.31,41.91 61.34,41.91 61.34,61.85 59.74,63.45 53.91,63.45 52.97,64.4 52.97,67.88 U$2.21
  Top 0.254: U$2.21 52.94,68.07 52.94,70.99 v52.58,70.99
  Bottom 0.254: v52.58,70.99 52.96,71.37 52.96,72.17 53.21,72.43 53.98,72.43 R12.1
TEMP_D8  (via drill 0.35)
  Top 0.203: R20.2 67.31,52.07 62.08,52.07 62.08,63.63 | 62.08,63.63 62.08,63.8 54.06,63.8 53.47,64.4 53.47,67.88 U$2.22 | 62.08,63.63 62.1,63.63
  Top 0.254: U$2.22 53.36,68.68 53.37,68.69 53.37,71.53 53.59,71.75 v53.72,71.75
  Bottom 0.254: R21.1 54.83,76.5 55.69,75.63 55.69,72.7 55.53,72.54 55.52,72.54 54.61,71.63 53.85,71.63 v53.72,71.75
TEMP_D9  (via drill 0.35)
  Top 0.203: R32.2 52.96,51.75 52.96,61.65 52.03,61.65 48.94,64.74 48.94,67.94 U$2.16
  Top 0.254: v48.77,67.94 48.94,67.94
  Bottom 0.254: R33.1 v48.77,67.94
TEMP_D10  (via drill 0.35)
  Top 0.152: v49.97,66.23 50.16,66.04
  Top 0.203: R29.2 49.53,41.78 54.36,41.78 54.36,62.13 52.56,62.13 50.16,64.52 50.16,66.04 50.04,66.17 50.04,70.36 49.99,70.41 U$2.15
  Top 0.254: v49.97,66.23 50.15,66.06 50.14,66.05
  Bottom 0.254: v49.97,66.23 49.78,66.04 R30.1
TEMP_D11  (via drill 0.35)
  Top 0.203: R26.2 49.53,25.4 54.41,25.4 54.41,32.41 53.4,33.41 53.4,35.17 54.64,36.41 55.5,36.41 55.5,62.74 52.96,62.74 50.86,64.84 U$2.17
  Top 0.254: U$2.17 50.8,67.93 v50.8,65.77
  Bottom 0.254: R27.1 51.69,72.26 50.92,71.5 50.92,70.22 50.67,69.96 50.67,65.9 v50.8,65.77
TEMP_D12  (via drill 0.35)
  Top 0.203: R23.2 33.02,25.4 39.88,25.4 39.88,54.74 50.04,54.74 50.04,61.74 47.5,64.28 47.5,69.34 47.5,70.87 47.54,70.91 U$2.14
  Top 0.254: 47.5,69.34 47.5,69.12 v47.42,69.04
  Bottom 0.254: R24.1 44.92,69.6 46.87,69.6 v47.42,69.04
TEMP_D13  (via drill 0.35)
  Top 0.203: R5.2 33.02,58.29 44.58,58.29 44.58,73.53 v46.1,75.06 46.11,75.07 46.47,75.07 48.13,73.41 48.14,73.41 U$2.9
  Bottom 0.254: R6.1 45.81,75.06 v46.1,75.06
TEMP_D14  (via drill 0.35)
  Top 0.203: R35.2 16.51,57.53 31.75,57.53 31.75,59.03 42.7,59.03 | 42.7,77.49 42.67,77.47 | U$2.8 48.83,74.02 48.1,74.02 45.72,76.39 v45.72,77.47
  Top 0.254: v45.72,77.47 42.67,77.47 | 42.7,77.49 42.7,59.03
  Bottom 0.254: R36.1 44.96,78.23 v45.72,77.47
TEMP_D15  (via drill 0.35)
  Top 0.203: R38.2 16.51,38.1 35.56,38.1 35.56,57.53 45.72,57.53 45.67,73.53 45.8,73.66 v46.4,73.66 47.37,73.66 48.13,72.9 48.93,72.9 U$2.10
  Bottom 0.203: v46.4,73.66 45.17,73.66 R39.1
TEMP_D16  (via drill 0.35)
  Top 0.203: R2.2 25.4,18.73 25.4,27.56 37.72,27.56 37.72,56.26 47.88,56.26 47.88,62.48 46.76,63.61 46.76,70.26 | U$2.11 46.72,72.41 46.76,72.37 46.76,70.26 | 46.76,70.26 v46.53,70.48
  Bottom 0.203: v46.53,70.48 45.48,71.54
  Bottom 0.254: R3.1 45.24,71.75 45.48,71.54
THERM_D1
  Bottom 1.27: 100.33,21.59 D1.THERMAL 100.33,15.24
  pour Bottom (isolate 0.305): 93.98,24.13 106.68,24.13 106.68,11.43 93.98,11.43
THERM_D2
  Bottom 1.27: 100.33,38.1 D2.THERMAL 100.33,30.48
  pour Bottom (isolate 0.305): 93.98,40.64 106.68,40.64 106.68,27.94 93.98,27.94
THERM_D3
  Bottom 1.27: 100.33,53.34 D3.THERMAL 100.33,48.26
  pour Bottom (isolate 0.305): 93.98,57.15 106.68,57.15 106.68,44.45 93.98,44.45
THERM_D4
  Bottom 1.27: 83.82,54.61 D4.THERMAL 83.82,48.26
  pour Bottom (isolate 0.305): 77.47,57.15 90.17,57.15 90.17,44.45 77.47,44.45
THERM_D5
  Bottom 1.27: 83.82,21.59 D5.THERMAL 83.82,13.97
  pour Bottom (isolate 0.305): 77.47,24.13 90.17,24.13 90.17,11.43 77.47,11.43
THERM_D6
  Bottom 1.27: 67.31,20.32 D6.THERMAL 67.31,15.24
  pour Bottom (isolate 0.305): 60.96,24.13 73.66,24.13 73.66,11.43 60.96,11.43
THERM_D7
  Bottom 1.27: 67.31,36.83 D7.THERMAL 67.31,29.21
  pour Bottom (isolate 0.305): 60.96,40.64 73.66,40.64 73.66,27.94 60.96,27.94
THERM_D8
  Bottom 1.27: 67.31,53.34 D8.THERMAL 67.31,48.26
  pour Bottom (isolate 0.305): 60.96,57.15 73.66,57.15 73.66,44.45 60.96,44.45
THERM_D9
  Bottom 1.27: 49.53,53.34 D9.THERMAL 49.53,48.26
  pour Bottom (isolate 0.305): 43.18,57.15 55.88,57.15 55.88,44.45 43.18,44.45
THERM_D10
  Bottom 1.27: 49.38,36.83 49.38,36.24 49.53,36.09 D10.THERMAL 49.53,30.48
  pour Bottom (isolate 0.305): 43.18,40.64 55.88,40.64 55.88,27.94 43.18,27.94
THERM_D11
  Bottom 1.27: 49.53,20.32 D11.THERMAL 49.53,15.24
  pour Bottom (isolate 0.305): 43.18,24.13 55.88,24.13 55.88,11.43 43.18,11.43
THERM_D12
  Bottom 1.27: 33.02,21.59 D12.THERMAL 33.02,15.24
  pour Bottom (isolate 0.305): 26.67,24.13 39.37,24.13 39.37,11.43 26.67,11.43
THERM_D13
  Bottom 1.27: 33.02,54.61 D13.THERMAL 33.02,46.99
  pour Bottom (isolate 0.305): 26.67,57.15 39.37,57.15 39.37,44.45 26.67,44.45
THERM_D14
  Bottom 1.27: 16.51,54.61 D14.THERMAL 16.51,48.26
  pour Bottom (isolate 0.305): 10.16,57.15 22.86,57.15 22.86,44.45 10.16,44.45
THERM_D15
  Bottom 1.27: 16.51,36.83 D15.THERMAL 16.51,31.75
  pour Bottom (isolate 0.305): 10.16,40.64 22.86,40.64 22.86,27.94 10.16,27.94
THERM_D16
  Bottom 1.27: 16.51,20.32 D16.THERMAL 16.51,15.24
  pour Bottom (isolate 0.305): 10.16,24.13 22.86,24.13 22.86,11.43 10.16,11.43
TOP_OFF  (via drill 0.35)
  Top 0.254: X1.2 109.22,85.84 109.22,86.17 | 109.22,86.17 109.22,86.36 109.47,86.36 109.47,85.98 R65.2 | R67.1 109.22,86.17
  Top 0.305: R67.1 107.82,85.98 v107.44,86.36 | v99.19,86.23 97.34,86.23 U$1.12
  Bottom 0.305: v107.44,86.36 99.06,86.36 v99.19,86.23
VCC  (via drill 0.3, 0.35, 0.55, 1 pad 1.3)
  Top 0.203: R22.2 v92.71,68.26 R10.2 | JMP2.1 41.86,100.06 U$21.3 | 76.43,79.6 76.02,80.01 v71.63,80.01
  Top 0.254: R4.2 R1.2 R13.2 | R13.2 R16.2 R7.2 | R13.2 v92.2,35.56 | R46.2 R43.2 R34.2 R31.2 24.26,36.52 v24.26,37.34 | v24.26,42.67 24.83,41.34 R28.2 | R19.2 83.82,39.69 v83.82,40.64 | JMP1.1 107.82,80.95 R67.2 108.9,82.87 v109.22,82.55 | U$1.4 104.66,85.09 81.92,85.09 76.43,79.6 IC1.1 76.43,77.63 C2.1
  Top 0.305: R68.2 5.08,77.79 PUMP0.1 | R69.2 15.24,79.06 PUMP1.1 | R70.2 25.4,80.33 FAN.1
  Top 0.406: R40.2 R37.2 R25.2 14.29,69.53 v16.51,67.31
  Top 1.27: U$21.1 36.51,110.49 v33.02,110.49
  Bottom 0.203: v92.71,68.26 92.71,67.31
  Bottom 0.254: v83.82,40.64 83.82,44.32 | 109.22,85.78 109.22,86.36
  Bottom 0.508: 51.44,17.78 D11.A | 65.41,17.78 D6.A | 18.41,50.8 D14.A | D13.A 34.92,50.8 | 51.44,50.8 D9.A | D8.A 65.41,50.8 | D15.A 24.13,34.29 | 18.41,17.78 D16.A | D12.A 34.92,17.78 | 51.56,34.29 D10.A | D7.A 65.41,34.29 | 82.04,50.42 D4.A | D3.A 98.68,50.55 98.55,50.55 | 98.55,33.15 98.93,33.53 D2.A | D1.A 98.42,17.78 | 81.92,17.91 82.04,17.78 D5.A
  Bottom 1.27: 34.92,25.02 42.29,25.02 44.45,22.86 51.31,22.86 51.44,22.99 51.44,17.78 | 34.92,25.02 24.13,25.02 | 24.13,25.02 24.13,34.29 24.26,35.18 | 24.26,35.18 v24.26,37.34 v24.26,42.67 24.26,44.32 | 92.2,44.32 v92.2,35.56 | v92.2,35.56 92.2,25.65 | 81.28,25.65 75.18,25.65 72.39,22.86 65.41,22.86 65.41,17.78 | 81.28,25.65 92.2,25.65 | 24.26,44.32 34.92,44.32 | 34.92,44.32 50.8,44.32 | 50.8,44.32 52.07,44.32 | 52.07,44.32 58.42,44.32 | 58.42,44.32 65.41,44.32 | 65.41,44.32 82.04,44.32 | 82.04,44.32 83.82,44.32 92.2,44.32 | 24.26,44.32 18.67,44.32 18.41,50.8 | 34.92,50.8 34.92,44.32 | 52.07,44.32 52.07,48.9 51.44,49.53 51.44,50.8 | 18.29,35.18 24.26,35.18 | 24.13,25.02 18.41,25.02 18.41,17.78 | 34.92,17.78 34.92,25.02 | 50.8,44.32 50.8,36.83 51.56,36.07 51.56,34.29 | 65.41,34.29 65.41,44.32 | 65.41,50.8 65.41,44.32 | 82.04,44.32 82.04,50.42 | 98.55,50.55 98.55,44.32 92.2,44.32 | v92.2,35.56 92.33,35.43 98.55,35.43 98.55,33.15 | 98.42,17.78 98.42,25.65 92.2,25.65 | 81.28,25.65 81.28,18.54 81.92,17.91 | 58.42,44.32 58.42,58.42 | 58.42,58.42 59.69,59.69 72.39,59.69 76.02,63.32 76.02,63.47 79.87,67.31 92.71,67.31 109.22,67.31 v109.22,82.55 109.22,86.36 109.22,87.05 | 109.22,87.05 U$1.2 U$1.4 | 109.22,87.05 109.22,88.91 109.04,89.09 109.04,91.59 113.03,95.58 113.03,106.68 110.03,109.68 54.94,109.68 48.9,103.63 45.77,103.63 J1.1 38.34,103.58 U$21.3 37.15,103.82 35.56,105.41 35.56,107.95 36.83,109.22 37.78,109.22 U$21.1 | 58.42,58.42 57.15,59.69 43.18,59.69 39.14,63.73 39.14,63.93 35.76,67.31 22.86,67.31 | 22.86,67.31 v16.51,67.31 | FAN.1 22.86,81.28 22.86,80.01 | 22.86,80.01 22.86,67.31 | 22.86,80.01 15.24,80.01
  Bottom 1.27: 15.24,80.01 PUMP1.1 | PUMP0.1 5.08,80.01 15.24,80.01

## Text on the board
tPlace: AquaSinc | v0.2 - April 2019 - C. J. Blocker | Raspberry Pi Zero W | Test | 5V | 3.3V | GND | STM32